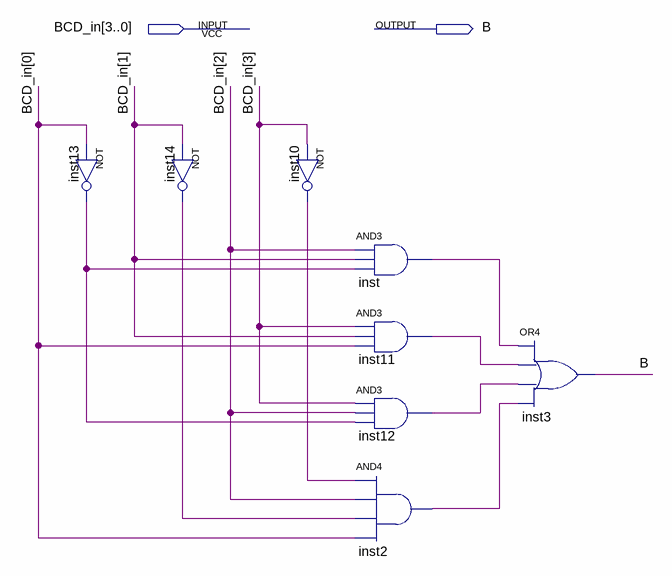
[diagram p0: schematic sheet]
// Quartus schematic B.bdf as structural Verilog: 8 symbols, 2 pins
module B (
  input  [3:0] BCD_in,
  output B
);

  wire inst2_out, inst10_out, inst11_out, inst12_out, inst13_out, inst14_out, inst_out;

  not inst13 (inst13_out, BCD_in[0]);
  not inst14 (inst14_out, BCD_in[1]);
  not inst10 (inst10_out, BCD_in[3]);
  and inst (inst_out, BCD_in[2], BCD_in[1], inst13_out);
  and inst11 (inst11_out, BCD_in[3], BCD_in[1], BCD_in[0]);
  and inst12 (inst12_out, BCD_in[3], BCD_in[2], inst13_out);
  and inst2 (inst2_out, inst10_out, BCD_in[2], inst14_out, BCD_in[0]);
  or inst3 (B, inst_out, inst11_out, inst12_out, inst2_out);
endmodule
